# Altium schematic sheet sensor.SchDoc
size A
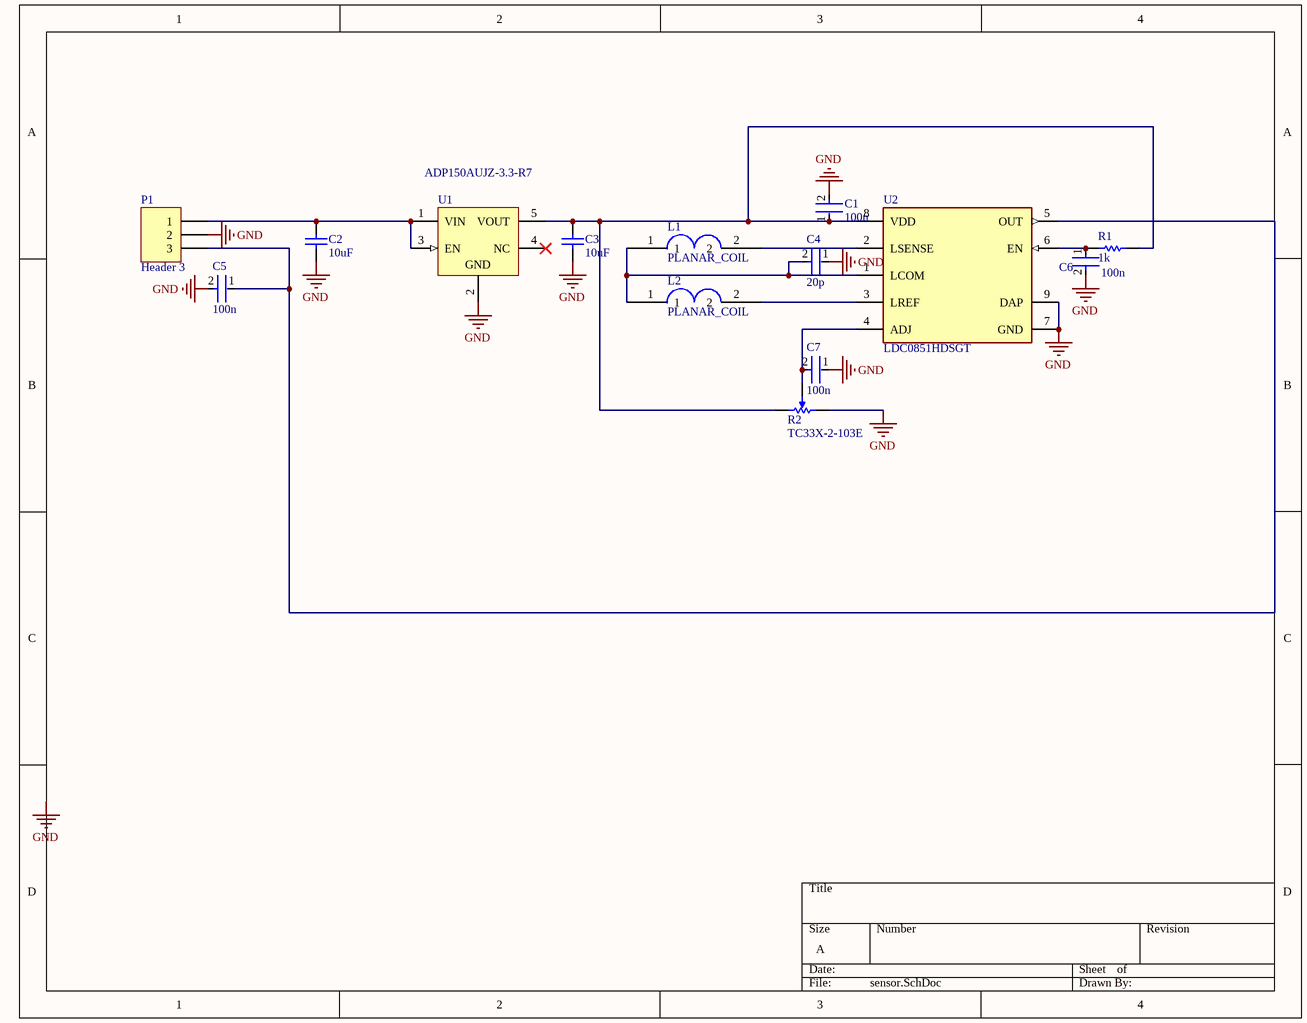
[diagram p0: sensor.SchDoc]

## Parts
C1  100n  [FP-GRM15-MFG]
C2  10uF  [CAPC2013X94X50ML20T25]
C3  10uF  [CAPC2013X94X50ML20T25]
C4  20p  [FP-GRM15-MFG]
C5  100n  [FP-GRM15-MFG]
C6  100n  [FP-GRM15-MFG]
C7  100n  [FP-GRM15-MFG]
L1  PLANAR_COIL  [PLANAR_INDUCTOR]  (net tie, no BOM)
L2  PLANAR_COIL  [PLANAR_INDUCTOR]  (net tie, no BOM)
P1  Header 3  [HDR1X3]
R1  1k  [RESC1005X40X25NL05T10]
R2  TC33X-2-103E  [BOUR-TC33X-2_V]
U1  ADP150AUJZ-3.3-R7  [ADI-UJ-5_M]
U2  LDC0851HDSGT  [FP-DSG0008A-MFG]

## Nets
GND: C1.2 C2.1 C3.1 C4.1 C5.2 C6.2 C7.1 P1.2 R2.1 U1.2(GND) U2.7(GND) U2.9(DAP)
NetC1_1: C1.1 C3.2 R1.2 R2.3 U1.5(VOUT) U2.8(VDD)
NetC2_2: C2.2 P1.1 U1.1(VIN) U1.3(EN)
NetC4_2: C4.2 L1.1 L2.1 U2.1(LCOM)
NetC5_1: C5.1 P1.3 U2.5(OUT)
NetC6_1: C6.1 R1.1 U2.6(EN)
NetC7_2: C7.2 R2.2 U2.4(ADJ)
NetL1_2: L1.2 U2.2(LSENSE)
NetL2_2: L2.2 U2.3(LREF)

Not connected (* = marked no-connect by the designer): U1 4(NC)*

## Notes on the sheet
- Labels drawn without touching a wire or pin: GND

## Library data of the parts
C1 C4-C7 = CMP-2100-03641-2: CAP CER 0.1UF 16V X7R 0402; Manufacturer Part Number: GRM155R71C104KA88D; Manufacturer: Murata; Standoff Height: 0mm; Tolerance: 10%; Voltage Rating: 16Vdc; Material: Ceramic; Capacitance: 0.10μF; Value: 0.10μF; RoHS: TRUE; Temperature Characteristic: X7R; Octopart: https://octopart.com/grm155r71c104ka88d-murata-196880; Digikey Description: CAP CER 0.1UF 16V X7R 0402; Device Class L3: Ceramic Capacitors; Height: 0.55mm; ComponentLink2Description: Datasheet; Temperature Range Low: -55°C; Ipc Land Pattern Name: CAPC10050X219; ComponentLink2URL: https://search.murata.co.jp/Ceramy/image/img/A01X/G101/ENG/GRM155R71H471KA01-01A.pdf; Device Class L1: Passive Components; Lead Free: yes; Category: Cap; Package: GRM15; Temperature: -55°C to +125°C; Device Class L2: Capacitors; Temperature Range High: +125°C; Mouser Description: 0402 0.1 uF 16V ±10 % Tolerance X7R SMT Multilayer Ceramic Capacitor
C2 C3 = CMP-1036-04427-2: Manufacturer: AVX Interconnect / Elco; Part Number: 08051C104JAT2A
P1 = Header 3: Header, 3-Pin; LatestRevisionDate: 17-Jul-2002; LatestRevisionNote: Re-released for DXP Platform.; Publisher: Altium Limited
R1 = CMP-1011-00001-2: Manufacturer: Yageo / Phycomp; Part Number: RC0402JR-070RL
R2 = CMP-2100-03695-1: Trimming Potentiometer, 10000 Ohm, -40 to 100 degC, 3-Pin SMD, RoHS, Tape and Reel; Manufacturer: Bourns; Tolerance: 25%; Max Power Dissipation: 100mW; Number of Turns: 1; Resistance: 10KOhm; Temperature Coefficient: 250ppm/degreesC; Voltage Rating (DC): 50V; Datasheet URL: http://www.bourns.com/docs/Product-Datasheets/TC33.pdf; Composition: Potentiometer; Package Description: 3-Pin Surface Mount Device, Body 3.8 x 3.6 mm; Weight: 29.4mg; Power Rating: 100mW; Termination: FootPrint; Manufacturer URL: http://www.bourns.com/; Width: 0.118inch; Height: 0.047inch; Military Standard: Not; Radiation Hardening: No; Colour: Silver; Case/Package: SMD/SMT; Depth: 3.8mm; Min Operating Temperature: -40degC; Lead Free: LeadFree; Datasheet Version: 42583.0; REACH SVHC: NoSVHC; Length: 3mm; RoHSCompliant: true; Contact Plating: Silver; Taper: Linear; Packaging: TapeandReel; Mount: SurfaceMount; Max Operating Temperature: 100degC; Package Reference: TC33X-2; Package Quantity: 2500
U1 = CMP-0786-00394-1: Ultralow Noise, 150 mA CMOS Linear Regulator, 2.2 to 5.5 V Vin, 3.3 V Vout, Industrial, 5-pin SOT23 (UJ-5), Reel; Manufacturer: Analog Devices; Supply Current IGND @ Small Load: 10uA; Vin (min) (V): 2.2; Iout max: 150mA; Preset Vout Values (V): 3.3; Vin (max) (V): 5.5; ComponentLink2Description: Datasheet; PackageReference: UJ-5; DatasheetVersion: Rev. A; PackageDescription: 5-Pin Thin Small Outline Transistor Package, Body 2.9 x 1.6 mm, Pitch 0.95 mm; ComponentLink4URL: Product URL:http://www.analog.com/en/ADP150/productSearch.html; Packing: Reel; ComponentLink1URL: http://www.analog.com/en/index.html; PartNumber: ADP150AUJZ-3.3-R7; PackageVersion: 100708-A, 10/2008; ComponentLink3Description: Package Specification; ComponentLink3URL: http:/www.analog.com/static/imported-files/packages/PKG_PDF/TSOT(UJ)/UJ_5.pdf; ComponentLink4Description: URL Link1; ComponentLink2URL: http://www.analog.com/static/imported-files/data_sheets/ADP150.pdf; Code_JEDEC: MO-193-AB; Mounting Technology: Surface Mount; ComponentLink1Description: Manufacturer URL
U2 = CMP-04947-000001-1: SENSOR PROX INDUCTIVE 8WFDFN; Turn-On Delay Time: 450us; Number of Inputs: 1; Max Supply Voltage: 3.46V; Min Supply Voltage: 1.71V; REACH SVHC: No SVHC; Packaging: Cut Tape; RoHS Compliant: Yes; Max Operating Temperature: 125°C; Lead Free: Lead Free; Termination: PC Pin; Sensing Method: Inductive; Min Operating Temperature: -40°C; Number of Pins: 8